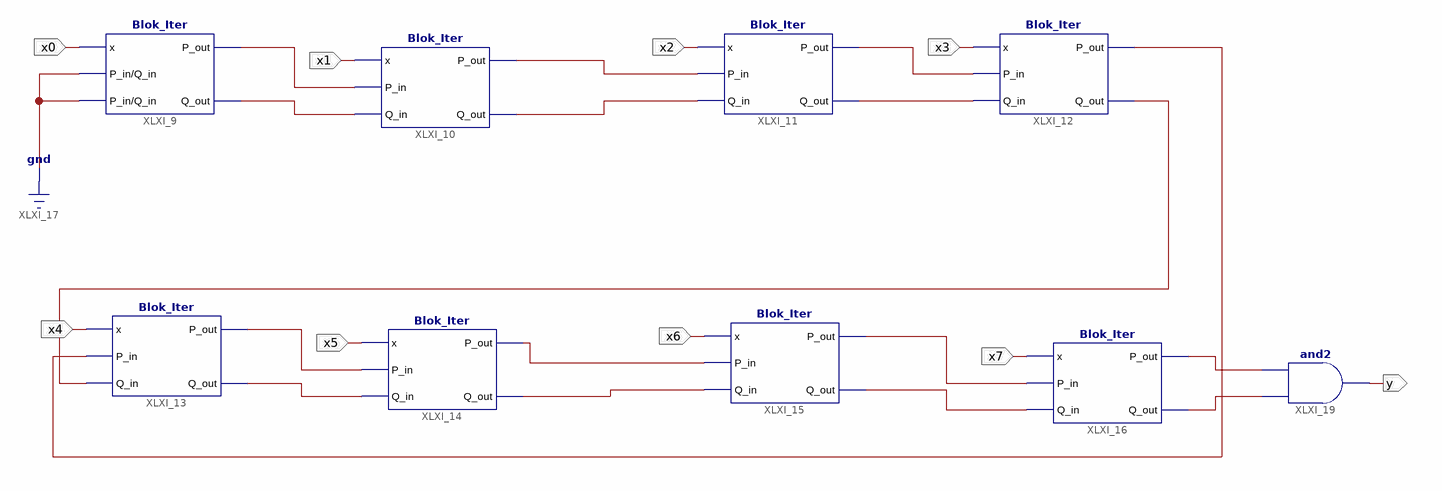
[diagram p0: schematic sheet 1]
// Xilinx ISE schematic Iter.sch (xbr) as structural Verilog: 9 symbols, 9 ports
module Iter (
  input  x3,
  input  x2,
  input  x1,
  input  x0,
  input  x4,
  input  x5,
  input  x6,
  input  x7,
  output y
);

  wire XLXN_3, XLXN_4, XLXN_5, XLXN_6, XLXN_8, XLXN_9, XLXN_10, XLXN_11, XLXN_12, XLXN_13, XLXN_14, XLXN_15,
       XLXN_17, XLXN_18, XLXN_20, XLXN_21;

  Blok_Iter XLXI_9 (.x(x0), .P_in(1'b0), .Q_in(1'b0), .P_out(XLXN_3), .Q_out(XLXN_4));
  Blok_Iter XLXI_10 (.x(x1), .P_in(XLXN_3), .Q_in(XLXN_4), .P_out(XLXN_5), .Q_out(XLXN_6));
  Blok_Iter XLXI_11 (.x(x2), .P_in(XLXN_5), .Q_in(XLXN_6), .P_out(XLXN_8), .Q_out(XLXN_9));
  Blok_Iter XLXI_12 (.x(x3), .P_in(XLXN_8), .Q_in(XLXN_9), .P_out(XLXN_10), .Q_out(XLXN_11));
  Blok_Iter XLXI_13 (.x(x4), .P_in(XLXN_10), .Q_in(XLXN_11), .P_out(XLXN_12), .Q_out(XLXN_13));
  Blok_Iter XLXI_14 (.x(x5), .P_in(XLXN_12), .Q_in(XLXN_13), .P_out(XLXN_14), .Q_out(XLXN_15));
  Blok_Iter XLXI_15 (.x(x6), .P_in(XLXN_14), .Q_in(XLXN_15), .P_out(XLXN_17), .Q_out(XLXN_18));
  Blok_Iter XLXI_16 (.x(x7), .P_in(XLXN_17), .Q_in(XLXN_18), .P_out(XLXN_20), .Q_out(XLXN_21));
  and XLXI_19 (y, XLXN_21, XLXN_20);
endmodule
